# Altium schematic sheet sensor.SchDoc
size A3
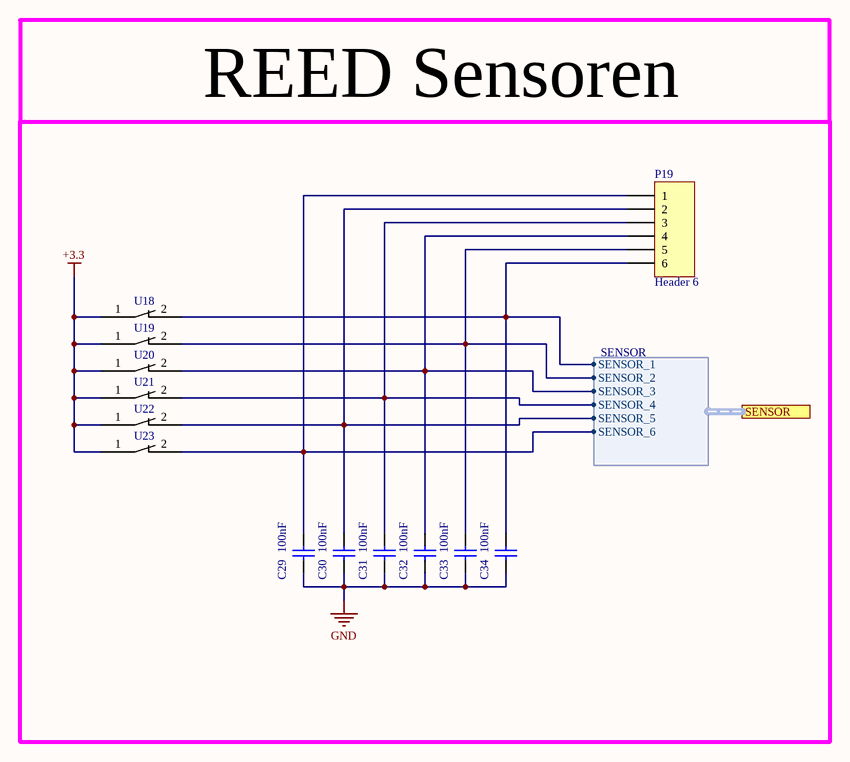
[diagram p0: sensor.SchDoc]

## Parts
C29  100nF  [CAP_0402i_1005m -N]
C30  100nF  [CAP_0402i_1005m -N]
C31  100nF  [CAP_0402i_1005m -N]
C32  100nF  [CAP_0402i_1005m -N]
C33  100nF  [CAP_0402i_1005m -N]
C34  100nF  [CAP_0402i_1005m -N]
P19  Header 6  [HDR1X6]
U18  reed_sensor  [MK 65B]  (value not drawn)
U19  reed_sensor  [MK 65B]  (value not drawn)
U20  reed_sensor  [MK 65B]  (value not drawn)
U21  reed_sensor  [MK 65B]  (value not drawn)
U22  reed_sensor  [MK 65B]  (value not drawn)
U23  reed_sensor  [MK 65B]  (value not drawn)

## Blocks framed on the sheet
REED Sensoren: C29-C34 P19 U18-U23

## Ports
SENSOR (harness SENSOR)

## Harnesses
SENSOR: SENSOR_1, SENSOR_2, SENSOR_3, SENSOR_4, SENSOR_5, SENSOR_6

## Nets
+3.3: U18.1 U19.1 U20.1 U21.1 U22.1 U23.1
GND: C29.1 C30.1 C31.1 C32.1 C33.1 C34.1
NetC29_2: C29.2 P19.1 U23.2 ; port SENSOR.SENSOR_6
NetC30_2: C30.2 P19.2 U22.2 ; port SENSOR.SENSOR_5
NetC31_2: C31.2 P19.3 U21.2 ; port SENSOR.SENSOR_4
NetC32_2: C32.2 P19.4 U20.2 ; port SENSOR.SENSOR_3
NetC33_2: C33.2 P19.5 U19.2 ; port SENSOR.SENSOR_2
NetC34_2: C34.2 P19.6 U18.2 ; port SENSOR.SENSOR_1

## Notes on the sheet
- 1
- 2
- 3
- 4
- 5
- 6
- 7
- 8
- A
- B
- C
- D
- Project:
- Date:
- Drawing number:
- Rev:
- Format:
- A3
- Drawn by:
- Laboratory:
- Page
- Sheet:
- of
- File:

## Library data of the parts
C29-C34 = Cap: capacitor
P19 = Header 6: Header, 6-Pin